# EAGLE schematic AudioProcessor (EAGLE 7.5.0)
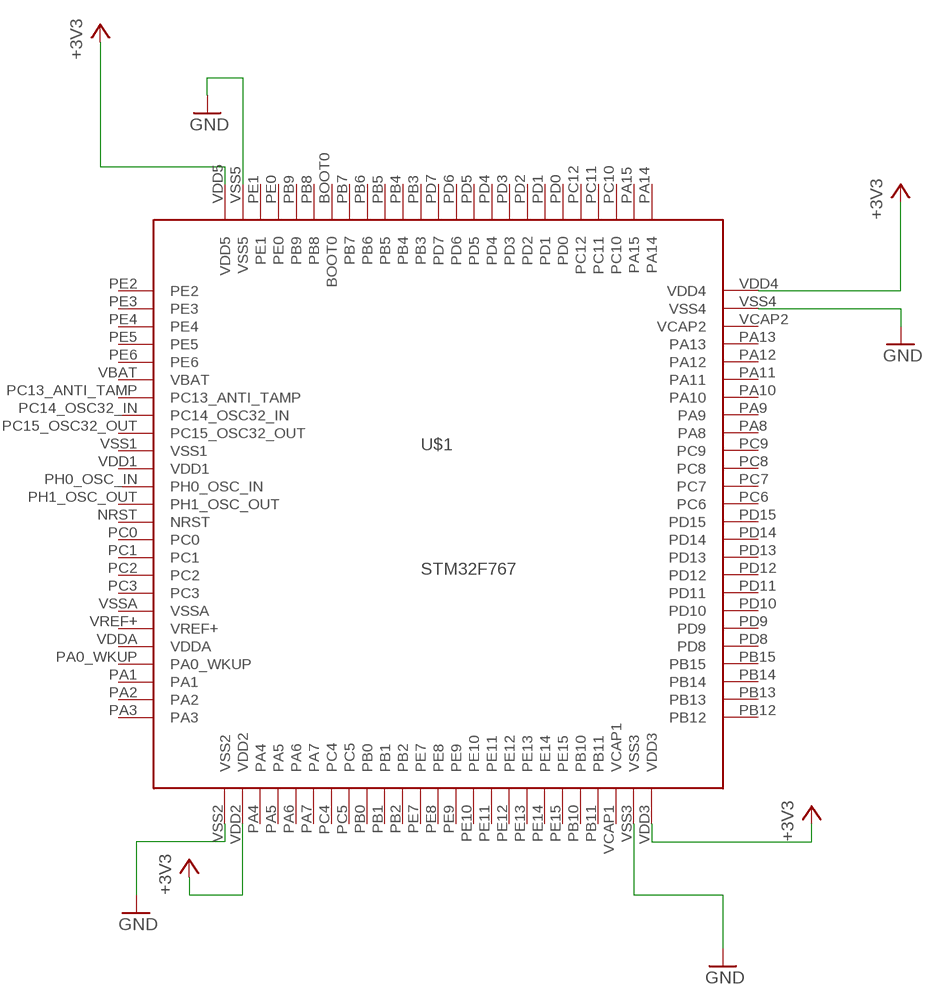
[diagram p0: schematic, sheet 1]

## Parts
U$1  STM32F767  [STM32F767]

## Nets
+3V3: U$1.VDD2 U$1.VDD3 U$1.VDD4 U$1.VDD5
GND: U$1.VSS2 U$1.VSS3 U$1.VSS4 U$1.VSS5
Unconnected: U$1.BOOT0 U$1.NRST U$1.PA0_WKUP U$1.PA1 U$1.PA2 U$1.PA3 U$1.PA4 U$1.PA5 U$1.PA6 U$1.PA7 U$1.PA8 U$1.PA9 U$1.PA10 U$1.PA11 U$1.PA12 U$1.PA13 U$1.PA14 U$1.PA15 U$1.PB0 U$1.PB1 U$1.PB2 U$1.PB3 U$1.PB4 U$1.PB5 U$1.PB6 U$1.PB7 U$1.PB8 U$1.PB9 U$1.PB10 U$1.PB11 U$1.PB12 U$1.PB13 U$1.PB14 U$1.PB15 U$1.PC0 U$1.PC1 U$1.PC2 U$1.PC3 U$1.PC4 U$1.PC5 U$1.PC6 U$1.PC7 U$1.PC8 U$1.PC9 U$1.PC10 U$1.PC11 U$1.PC12 U$1.PC13_ANTI_TAMP U$1.PC14_OSC32_IN U$1.PC15_OSC32_OUT U$1.PD0 U$1.PD1 U$1.PD2 U$1.PD3 U$1.PD4 U$1.PD5 U$1.PD6 U$1.PD7 U$1.PD8 U$1.PD9 U$1.PD10 U$1.PD11 U$1.PD12 U$1.PD13 U$1.PD14 U$1.PD15 U$1.PE0 U$1.PE1 U$1.PE2 U$1.PE3 U$1.PE4 U$1.PE5 U$1.PE6 U$1.PE7 U$1.PE8 U$1.PE9 U$1.PE10 U$1.PE11 U$1.PE12 U$1.PE13 U$1.PE14 U$1.PE15 U$1.PH0_OSC_IN U$1.PH1_OSC_OUT U$1.VBAT U$1.VCAP1 U$1.VCAP2 U$1.VDD1 U$1.VDDA U$1.VREF+ U$1.VSS1 U$1.VSSA

## Library data of the parts
U$1 = My_STM32F767:STM32F767